# EasyEDA Pro project 立创EDA工程文件.epro

# Board PCB
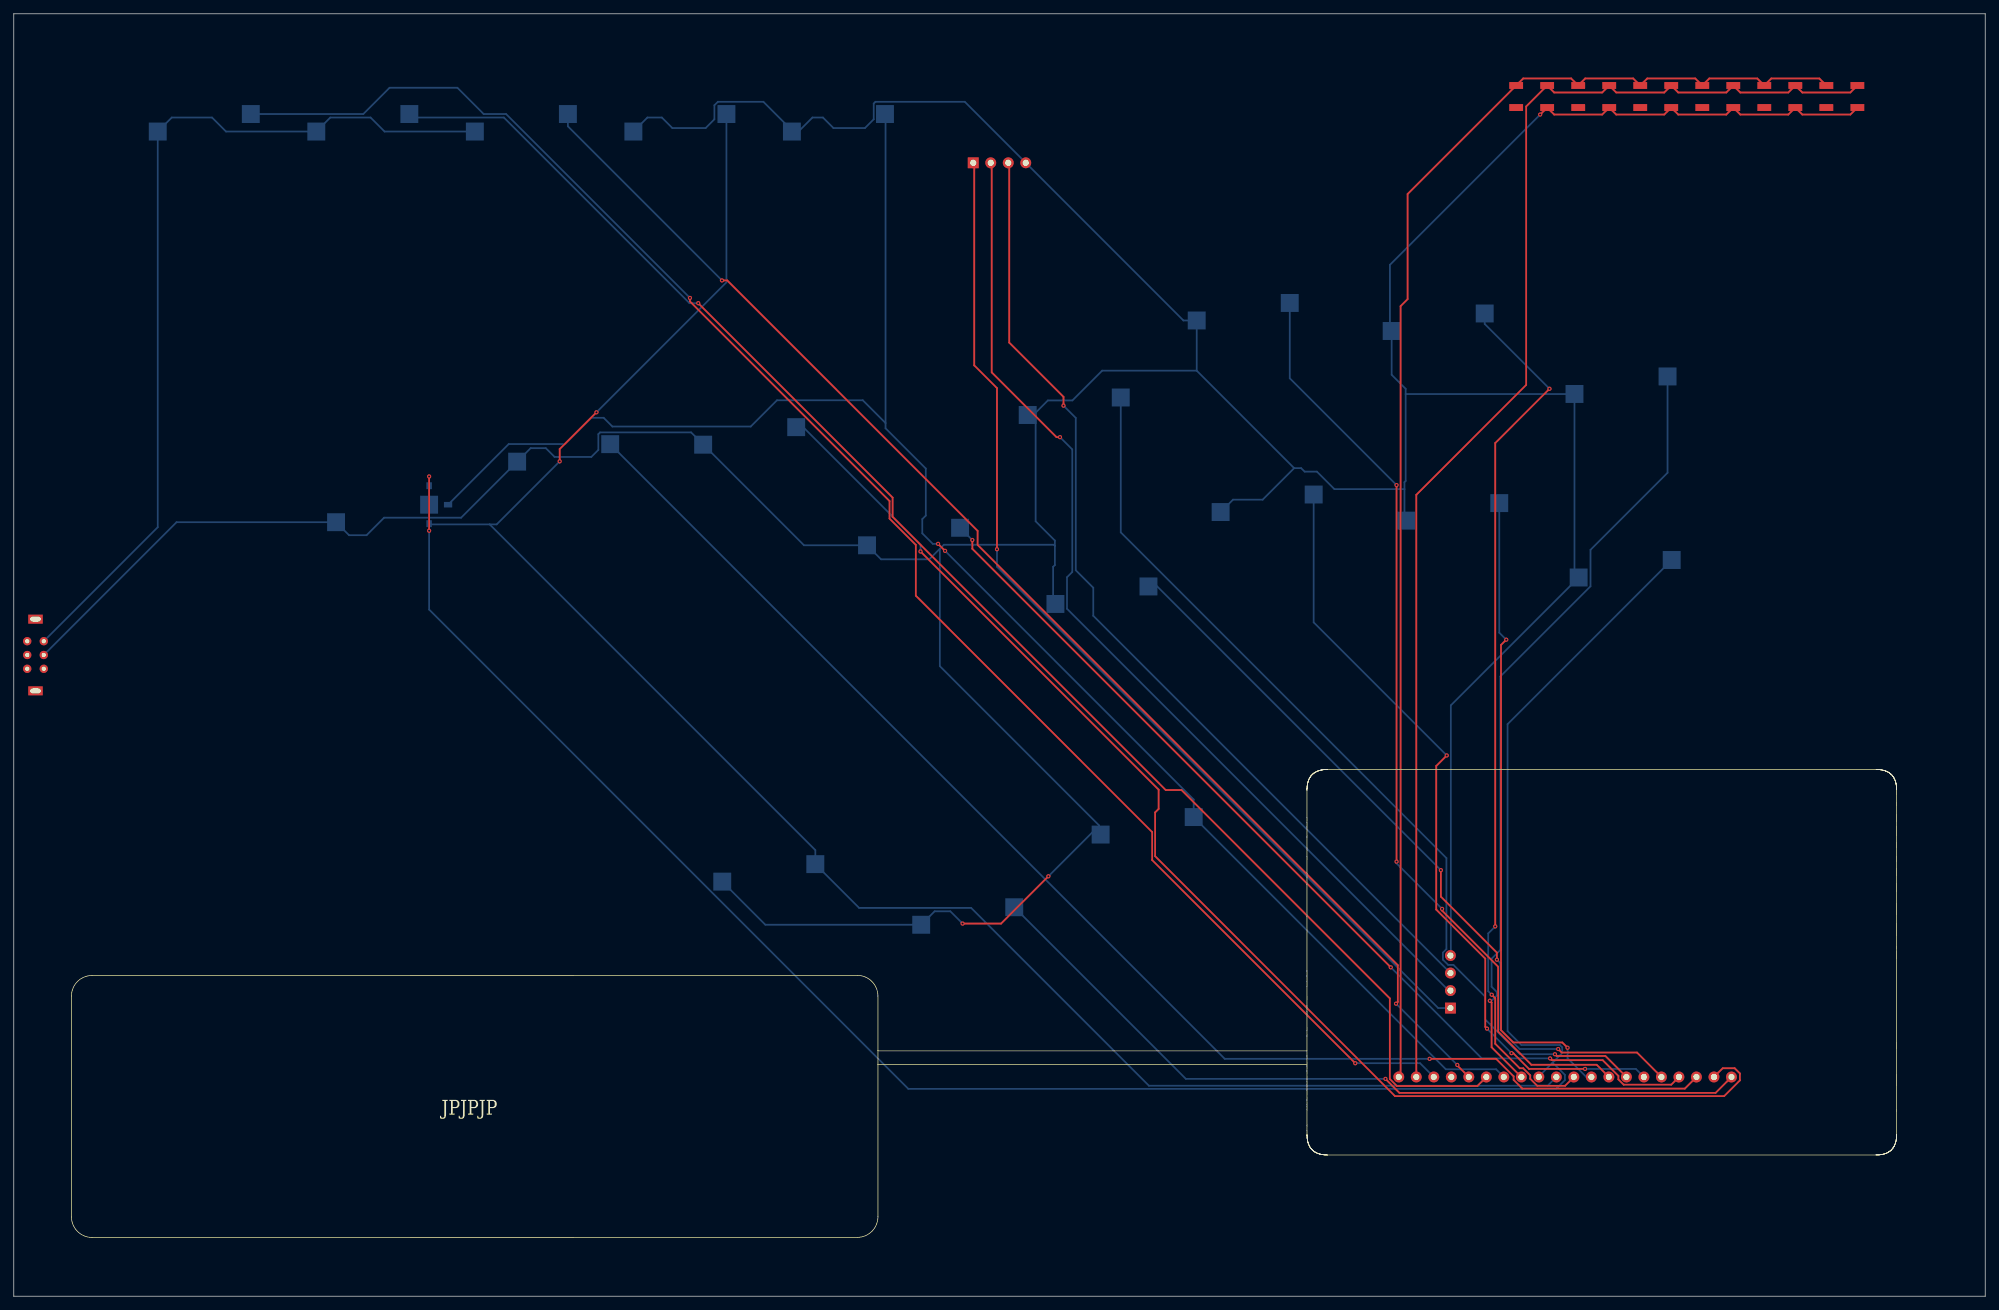
[diagram p0: board, top side]
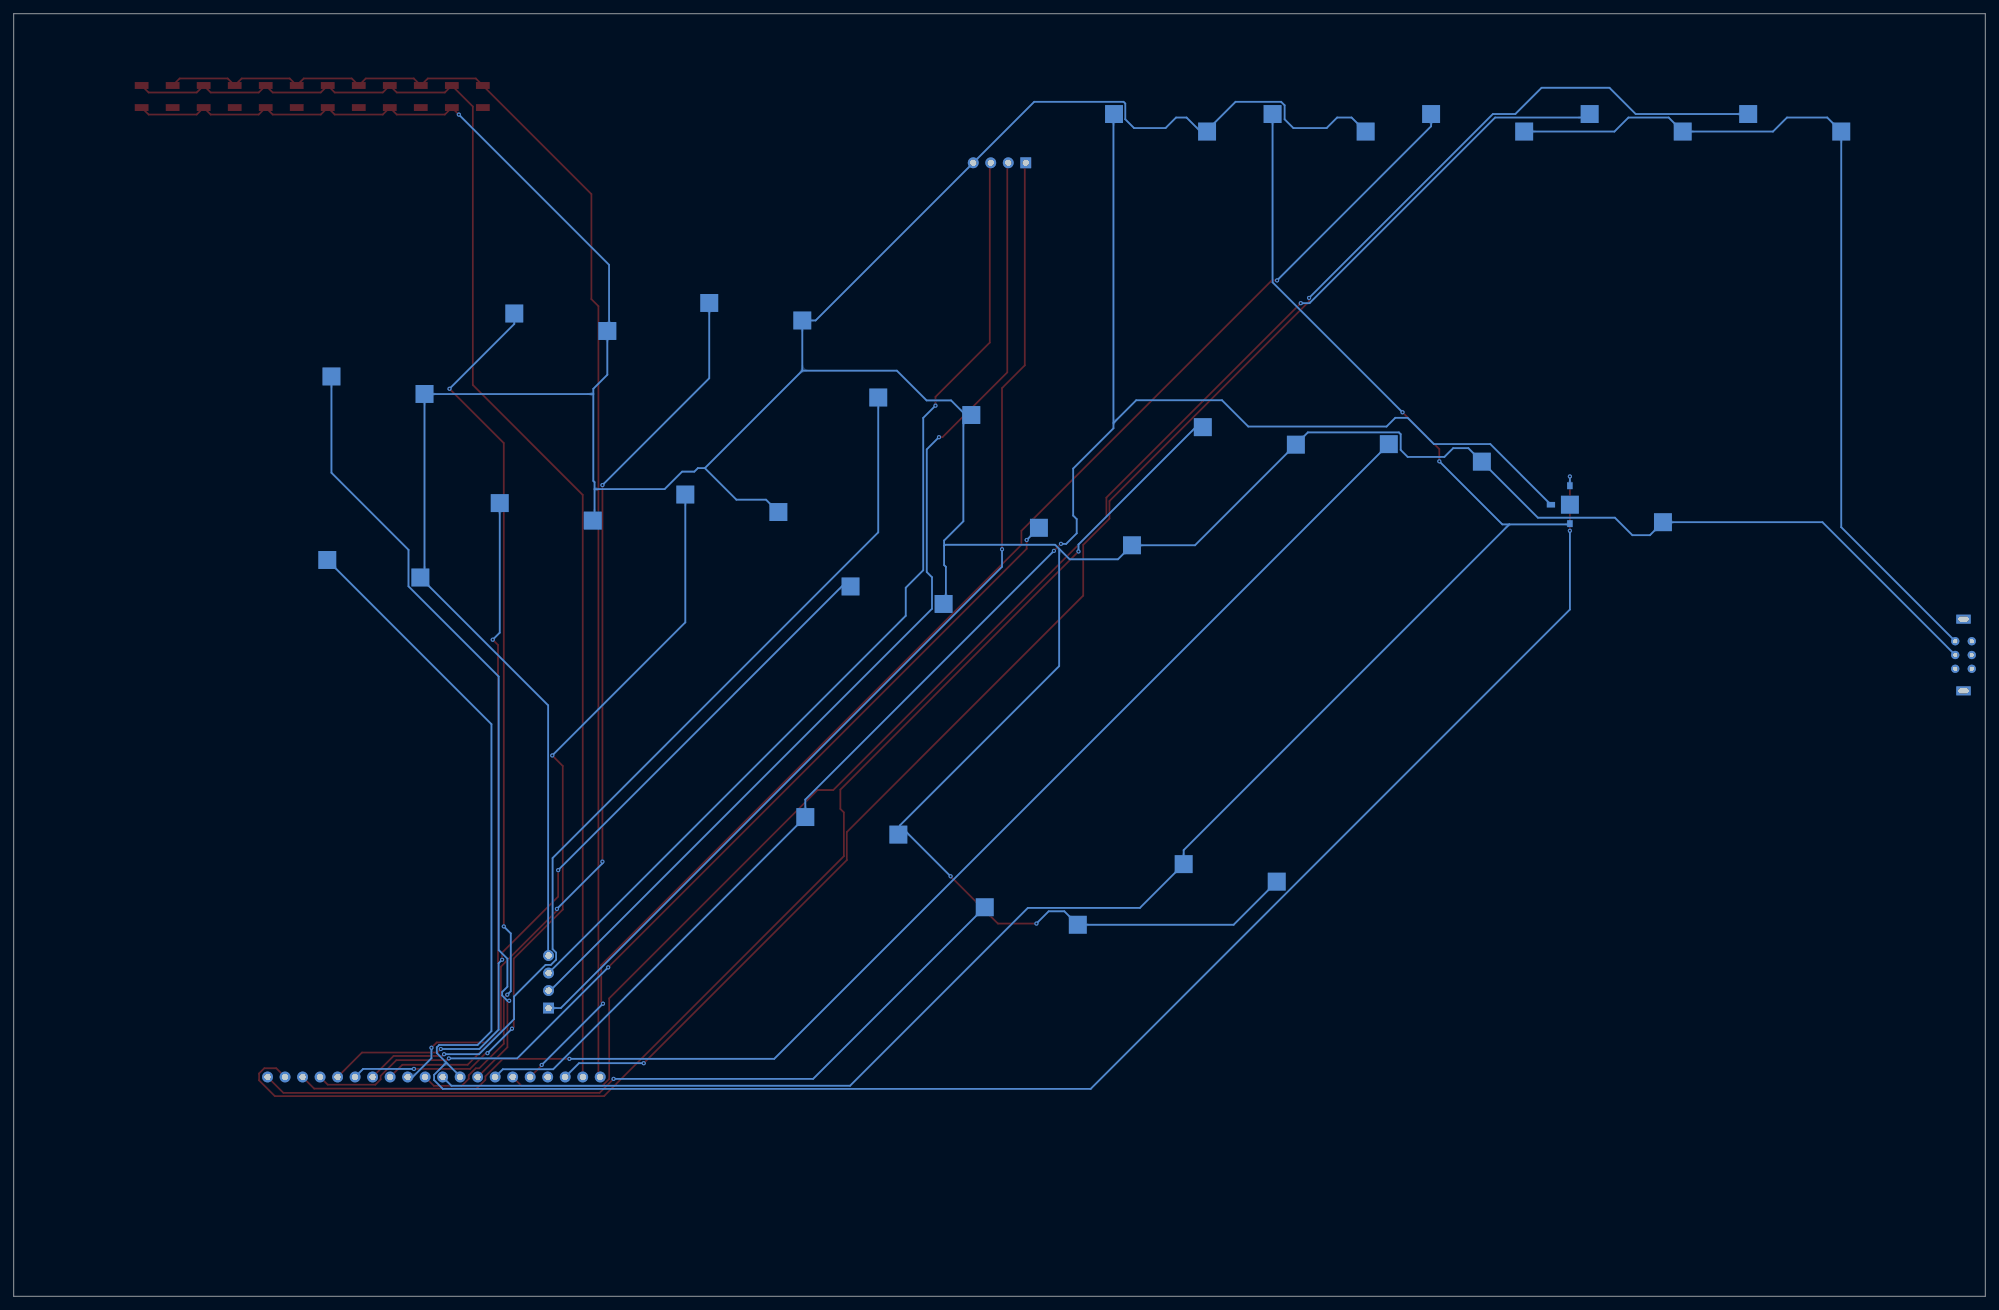
[diagram p1: board, bottom side, seen from below]

Outline 286 x 186 mm; copper layers: Top Layer, Bottom Layer. Coordinates in mm from the lower left corner of the outline.
Outline path: 0,186 286,186 286,0 0,0 0,186
Stack: Top Layer 0.035mm / Dielectric1 1.51mm FR4 er 4.5 / Bottom Layer 0.035mm

## Design rules (mm)
template: JLCPCB Capability(Two Layers Board)
spacing copperThickness1oz (default): track to track 0.102, other pairs 0.152 to 0.3
spacing copperThickness2oz: track to track 0.203, other pairs 0.152 to 0.3
track width copperThickness1oz (default): min 0.127, default 0.254, max 2.54
track width copperThickness2oz: min 0.203, default 0.254, max 2.54
differential pair differentialPair (default): width min 0.127, default 0.254, max 2.54; gap min 0.152, default 0.152
via viaSize (default): diameter min 0.5, default 0.61, max 10; hole min 0.3, default 0.305, max 6.3

## Placement (name value [footprint] x y rotation side)
NOREF  -  [Pad_e293]  215.5 115.03 0 top
NOREF#2  -  [Pad_e256]  239.03 31.79 0 top
NOREF#3  -  [Pad_e380]  60.25 117.55 180 top
NOREF#4  -  [Pad_e311]  103.39 171.46 0 top
NOREF#5  -  [Pad_e259]  246.65 31.79 0 top
NOREF#6  -  [Pad_e306]  20.89 168.92 0 top
NOREF#7  -  [Pad_ie246]  231.45 175.6 0 top
NOREF#8  -  [Pad_e307]  57.38 171.46 0 top
NOREF#9  -  [Pad_e254]  233.95 31.79 0 top
NOREF#10  -  [Pad_e247]  216.17 31.79 0 top
NOREF#11  -  [Pad_e248]  218.71 31.79 0 top
NOREF#12  -  [Pad_e310]  66.89 168.92 0 top
NOREF#13  -  [Pad_e291]  240.52 106.78 0 top
NOREF#14  -  [Pad_ie259]  253.95 172.4 0 top
NOREF#15  -  [Pad_ie264]  262.95 175.6 0 top
NOREF#16  -  [Pad_ie253]  249.45 172.4 0 top
NOREF#17  -  [Pad_e249]  221.25 31.79 0 top
NOREF#18  -  [Pad_e239]  206.01 31.79 0 top
NOREF#19  -  [Pad_e282]  46.75 112.26 0 top
NOREF#20  -  [Pad_e253]  231.41 31.79 0 top
NOREF#21  -  [Pad_e281]  60.25 114.8 0 top
NOREF#22  -  [Pad_ie249]  240.45 172.4 0 top
NOREF#23  -  [Pad_e301]  145.14 56.41 0 top
NOREF#24  -  [Pad_e339]  3.15 87.8 0 top
NOREF#25  -  [Pad_e290]  226.41 130.86 0 top
NOREF#26  -  [Pad_e308]  43.88 168.92 0 top
NOREF#27  -  [Pad_e302]  131.64 53.87 0 top
NOREF#28  -  [Pad_e379]  63 114.8 90 top
NOREF#29  -  [Pad_e292]  227.02 104.24 0 top
NOREF#30  -  [Pad_e260]  249.19 31.79 0 top
NOREF#31  -  [Pad_e287]  213.39 142.53 0 top
NOREF#32  -  [Pad_ie256]  244.95 175.6 0 top
NOREF#33  -  [Pad_e243]  208.42 41.79 270 top
NOREF#34  -  [Pad_e288]  199.89 139.99 0 top
NOREF#35  -  [Pad_e371]  144.27 164.39 180 top
NOREF#36  -  [Pad_e285]  185.11 144.06 0 top
NOREF#37  -  [Pad_ie255]  244.95 172.4 0 top
NOREF#38  -  [Pad_e244]  208.55 31.79 0 top
NOREF#39  -  [Pad_e274]  160.59 130.35 0 top
NOREF#40  -  [Pad_e313]  126.38 171.46 0 top
NOREF#41  -  [Pad_e295]  188.58 116.28 0 top
NOREF#42  -  [Pad_e312]  89.89 168.92 0 top
NOREF#43  -  [Pad_e276]  123.78 108.91 0 top
NOREF#44  -  [Pad_e314]  112.89 168.92 0 top
NOREF#45  -  [Pad_e324]  1.95 93 270 top
NOREF#46  -  [Pad_e278]  100.01 123.51 0 top
NOREF#47  -  [Pad_e378]  60.25 112.05 0 top
NOREF#48  -  [Pad_e325]  4.35 93 270 top
NOREF#49  -  [Pad_e296]  175.08 113.74 0 top
NOREF#50  -  [Pad_e250]  223.79 31.79 0 top
NOREF#51  -  [Pad_ie241]  222.45 172.4 0 top
NOREF#52  -  [Pad_ie242]  222.45 175.6 0 top
NOREF#53  -  [Pad_ie258]  258.45 175.6 0 top
NOREF#54  -  [Pad_e240]  208.42 46.87 270 top
NOREF#55  -  [Pad_e297]  164.61 102.94 0 top
NOREF#56  -  [Pad_ie245]  231.45 172.4 0 top
NOREF#57  -  [Pad_e242]  208.42 44.33 270 top
NOREF#58  -  [Pad_e273]  147.09 127.81 0 top
NOREF#59  -  [Pad_e323]  1.95 95 270 top
NOREF#60  -  [Pad_e294]  202 112.49 0 top
NOREF#61  -  [Pad_e252]  228.87 31.79 0 top
NOREF#62  -  [Pad_e327]  1.95 91 270 top
NOREF#63  -  [Pad_e373]  139.19 164.39 180 top
NOREF#64  -  [Pad_e303]  116.28 62.67 0 top
NOREF#65  -  [Pad_e304]  102.78 60.13 0 top
NOREF#66  -  [Pad_e238]  203.47 31.79 0 top
NOREF#67  -  [Pad_ie252]  235.95 175.6 0 top
NOREF#68  -  [Pad_e326]  4.35 91 270 top
NOREF#69  -  [Pad_e298]  151.11 100.4 0 top
NOREF#70  -  [Pad_e372]  146.81 164.39 180 top
NOREF#71  -  [Pad_e275]  137.28 111.45 0 top
NOREF#72  -  [Pad_e300]  157.67 66.95 0 top
NOREF#73  -  [Pad_ie254]  249.45 175.6 0 top
NOREF#74  -  [Pad_e246]  213.63 31.79 0 top
NOREF#75  -  [Pad_e299]  171.17 69.49 0 top
NOREF#76  -  [Pad_e245]  211.09 31.79 0 top
NOREF#77  -  [Pad_e286]  171.61 141.52 0 top
NOREF#78  -  [Pad_e309]  80.39 171.46 0 top
NOREF#79  -  [Pad_ie243]  217.95 172.4 0 top
NOREF#80  -  [Pad_ie244]  217.95 175.6 0 top
NOREF#81  -  [Pad_ie260]  253.95 175.6 0 top
NOREF#82  -  [Pad_e279]  86.52 123.58 0 top
NOREF#83  -  [Pad_e251]  226.33 31.79 0 top
NOREF#84  -  [Pad_e289]  239.91 133.4 0 top
NOREF#85  -  [Pad_e258]  244.11 31.79 0 top
NOREF#86  -  [Pad_e277]  113.51 126.05 0 top
NOREF#87  -  [Pad_e255]  236.49 31.79 0 top
NOREF#88  -  [Pad_e237]  200.93 31.79 0 top
NOREF#89  -  [Pad_ie250]  240.45 175.6 0 top
NOREF#90  -  [Pad_e322]  4.35 95 270 top
NOREF#91  -  [Pad_ie262]  267.45 175.6 0 top
NOREF#92  -  [Pad_ie248]  226.95 175.6 0 top
NOREF#93  -  [Pad_e338]  3.15 98.2 0 top
NOREF#94  -  [Pad_ie247]  226.95 172.4 0 top
NOREF#95  -  [Pad_e257]  241.57 31.79 0 top
NOREF#96  -  [Pad_ie261]  267.45 172.4 0 top
NOREF#97  -  [Pad_e370]  141.73 164.39 180 top
NOREF#98  -  [Pad_ie257]  258.45 172.4 0 top
NOREF#99  -  [Pad_ie251]  235.95 172.4 0 top
NOREF#100  -  [Pad_e280]  73.02 121.04 0 top
NOREF#101  -  [Pad_e305]  34.38 171.46 0 top
NOREF#102  -  [Pad_e241]  208.42 49.41 270 top
NOREF#103  -  [Pad_ie263]  262.95 172.4 0 top

## Footprints (pads in the part's own frame, mm; a bottom-side part is the same pattern mirrored in y, then rotated)
Pad_e237
  round 1.575 hole 0.889: (0,0)
Pad_e238
  round 1.575 hole 0.889: (0,0)
Pad_e239
  round 1.575 hole 0.889: (0,0)
Pad_e240
  round 1.575 hole 0.889: (0,0)
Pad_e241
  round 1.575 hole 0.889: (0,0)
Pad_e242
  round 1.575 hole 0.889: (0,0)
Pad_e243
  rect 1.575x1.575 hole 0.889: (0,0)
Pad_e244
  round 1.575 hole 0.889: (0,0)
Pad_e245
  round 1.575 hole 0.889: (0,0)
Pad_e246
  round 1.575 hole 0.889: (0,0)
Pad_e247
  round 1.575 hole 0.889: (0,0)
Pad_e248
  round 1.575 hole 0.889: (0,0)
Pad_e249
  round 1.575 hole 0.889: (0,0)
Pad_e250
  round 1.575 hole 0.889: (0,0)
Pad_e251
  round 1.575 hole 0.889: (0,0)
Pad_e252
  round 1.575 hole 0.889: (0,0)
Pad_e253
  round 1.575 hole 0.889: (0,0)
Pad_e254
  round 1.575 hole 0.889: (0,0)
Pad_e255
  round 1.575 hole 0.889: (0,0)
Pad_e256
  round 1.575 hole 0.889: (0,0)
Pad_e257
  round 1.575 hole 0.889: (0,0)
Pad_e258
  round 1.575 hole 0.889: (0,0)
Pad_e259
  round 1.575 hole 0.889: (0,0)
Pad_e260
  round 1.575 hole 0.889: (0,0)
Pad_e273
  rect 2.6x2.6 smd far side: (0,0)
Pad_e274
  rect 2.6x2.6 smd far side: (0,0)
Pad_e275
  rect 2.6x2.6 smd far side: (0,0)
Pad_e276
  rect 2.6x2.6 smd far side: (0,0)
Pad_e277
  rect 2.6x2.6 smd far side: (0,0)
Pad_e278
  rect 2.6x2.6 smd far side: (0,0)
Pad_e279
  rect 2.6x2.6 smd far side: (0,0)
Pad_e280
  rect 2.6x2.6 smd far side: (0,0)
Pad_e281
  rect 2.6x2.6 smd far side: (0,0)
Pad_e282
  rect 2.6x2.6 smd far side: (0,0)
Pad_e285
  rect 2.6x2.6 smd far side: (0,0)
Pad_e286
  rect 2.6x2.6 smd far side: (0,0)
Pad_e287
  rect 2.6x2.6 smd far side: (0,0)
Pad_e288
  rect 2.6x2.6 smd far side: (0,0)
Pad_e289
  rect 2.6x2.6 smd far side: (0,0)
Pad_e290
  rect 2.6x2.6 smd far side: (0,0)
Pad_e291
  rect 2.6x2.6 smd far side: (0,0)
Pad_e292
  rect 2.6x2.6 smd far side: (0,0)
Pad_e293
  rect 2.6x2.6 smd far side: (0,0)
Pad_e294
  rect 2.6x2.6 smd far side: (0,0)
Pad_e295
  rect 2.6x2.6 smd far side: (0,0)
Pad_e296
  rect 2.6x2.6 smd far side: (0,0)
Pad_e297
  rect 2.6x2.6 smd far side: (0,0)
Pad_e298
  rect 2.6x2.6 smd far side: (0,0)
Pad_e299
  rect 2.6x2.6 smd far side: (0,0)
Pad_e300
  rect 2.6x2.6 smd far side: (0,0)
Pad_e301
  rect 2.6x2.6 smd far side: (0,0)
Pad_e302
  rect 2.6x2.6 smd far side: (0,0)
Pad_e303
  rect 2.6x2.6 smd far side: (0,0)
Pad_e304
  rect 2.6x2.6 smd far side: (0,0)
Pad_e305
  rect 2.6x2.6 smd far side: (0,0)
Pad_e306
  rect 2.6x2.6 smd far side: (0,0)
Pad_e307
  rect 2.6x2.6 smd far side: (0,0)
Pad_e308
  rect 2.6x2.6 smd far side: (0,0)
Pad_e309
  rect 2.6x2.6 smd far side: (0,0)
Pad_e310
  rect 2.6x2.6 smd far side: (0,0)
Pad_e311
  rect 2.6x2.6 smd far side: (0,0)
Pad_e312
  rect 2.6x2.6 smd far side: (0,0)
Pad_e313
  rect 2.6x2.6 smd far side: (0,0)
Pad_e314
  rect 2.6x2.6 smd far side: (0,0)
Pad_e322
  round 1.2 hole 0.6: (0,0)
Pad_e323
  round 1.2 hole 0.6: (0,0)
Pad_e324
  round 1.2 hole 0.6: (0,0)
Pad_e325
  round 1.2 hole 0.6: (0,0)
Pad_e326
  round 1.2 hole 0.6: (0,0)
Pad_e327
  round 1.2 hole 0.6: (0,0)
Pad_e338
  rect 2.1x1.3 hole 1.5x0.7: (0,0)
Pad_e339
  rect 2.1x1.3 hole 1.5x0.7: (0,0)
Pad_e370
  round 1.575 hole 0.889: (0,0)
Pad_e371
  round 1.575 hole 0.889: (0,0)
Pad_e372
  round 1.575 hole 0.889: (0,0)
Pad_e373
  rect 1.575x1.575 hole 0.889: (0,0)
Pad_e378
  rect 0.8x1 smd far side: (0,0)
Pad_e379
  rect 0.8x1.2 smd far side: (0,0)
Pad_e380
  rect 0.8x1 smd far side: (0,0)
Pad_ie241
  rect 2x1 smd: (0,0)
Pad_ie242
  rect 2x1 smd: (0,0)
Pad_ie243
  rect 2x1 smd: (0,0)
Pad_ie244
  rect 2x1 smd: (0,0)
Pad_ie245
  rect 2x1 smd: (0,0)
Pad_ie246
  rect 2x1 smd: (0,0)
Pad_ie247
  rect 2x1 smd: (0,0)
Pad_ie248
  rect 2x1 smd: (0,0)
Pad_ie249
  rect 2x1 smd: (0,0)
Pad_ie250
  rect 2x1 smd: (0,0)
Pad_ie251
  rect 2x1 smd: (0,0)
Pad_ie252
  rect 2x1 smd: (0,0)
Pad_ie253
  rect 2x1 smd: (0,0)
Pad_ie254
  rect 2x1 smd: (0,0)
Pad_ie255
  rect 2x1 smd: (0,0)
Pad_ie256
  rect 2x1 smd: (0,0)
Pad_ie257
  rect 2x1 smd: (0,0)
Pad_ie258
  rect 2x1 smd: (0,0)
Pad_ie259
  rect 2x1 smd: (0,0)
Pad_ie260
  rect 2x1 smd: (0,0)
Pad_ie261
  rect 2x1 smd: (0,0)
Pad_ie262
  rect 2x1 smd: (0,0)
Pad_ie263
  rect 2x1 smd: (0,0)
Pad_ie264
  rect 2x1 smd: (0,0)

## Nets
GND: NOREF#16. NOREF#19. NOREF#22. NOREF#25. NOREF#27. NOREF#29. NOREF#34. NOREF#42. NOREF#43. NOREF#44. NOREF#46. NOREF#48. NOREF#49. NOREF#51. NOREF#56. NOREF#58. NOREF#60. NOREF#65. NOREF#69. NOREF#70. NOREF#72. NOREF#77. NOREF#96. NOREF#98. NOREF#100. NOREF#102.
GND1: NOREF#6. NOREF#12. NOREF#26. NOREF#90.
VCC: NOREF#15. NOREF#32. NOREF#67. NOREF#80. NOREF#81. NOREF#88. NOREF#92.
+: NOREF#33. NOREF#63.
A: NOREF#2. NOREF#55.
B: NOREF#41. NOREF#87.
D+: NOREF#35. NOREF#54.
D-: NOREF#57. NOREF#97.
DIN: NOREF#7. NOREF#52. NOREF#53. NOREF#66. NOREF#73. NOREF#89. NOREF#91.
DOWN: NOREF#5. NOREF#86.
HOME: NOREF#18. NOREF#101.
L1: NOREF. NOREF#61.
L2: NOREF#31. NOREF#83.
L3: NOREF#4. NOREF#47. NOREF#50. NOREF#64.
LEFT: NOREF#82. NOREF#85.
R1: NOREF#3. NOREF#13. NOREF#17.
R2: NOREF#11. NOREF#84.
R3: NOREF#10. NOREF#28. NOREF#40. NOREF#75.
RIGHT: NOREF#71. NOREF#95.
SELECT: NOREF#8. NOREF#74.
START: NOREF#76. NOREF#78.
UP: NOREF#23. NOREF#30.
X: NOREF#9. NOREF#39.
Y: NOREF#20. NOREF#36.

## Via types
v1: diameter 0.61, hole 0.305, Top Layer to Bottom Layer, 41 vias

## Routing (per net, layer and track width the routed paths; a pad name or vN(x,y) marks a point on that pad's centre or on a via; arc(x,y) is an arc through that point)
GND: length 741.2
  Top Layer w0.254: v1(150.09,60.91) 143.23,54.05 v1(137.64,54.05) ; v1(221.44,171.38) 222.45,172.4 223.47,171.38 230.44,171.38 231.45,172.4 232.47,171.38 239.44,171.38 240.45,172.4 241.47,171.38 248.44,171.38 249.45,172.4 250.47,171.38 257.44,171.38 258.45,172.4 259.47,171.38 266.44,171.38 267.45,172.4
  Bottom Layer w0.254: 157.46,67.26 157.46,67.17 157.67,66.95 ; 157.46,67.26 157.46,68.27 134.34,91.39 134.34,108.4 ; 157.46,67.26 156.44,67.26 v1(150.09,60.91) ; 171.61,134.24 171.61,141.52 169.68,141.52 146.81,164.39 137.96,173.24 125,173.24 124.75,172.98 124.75,170.7 123.48,169.43 118.91,169.43 117.39,170.95 115.86,170.95 113.83,168.92 113.07,168.92 ; 171.61,134.24 157.89,134.24 153.57,129.92 150.02,129.92 148.24,128.14 ; 171.61,134.24 185.75,120.1 ; 134.34,108.4 132.82,106.88 125.81,106.88 123.78,108.91 114.64,108.91 100.04,123.51 ; 134.34,108.4 134.93,108.99 150.89,108.99 151.03,108.84 ; 102.78,60.13 109.04,53.87 131.64,53.87 133.59,55.83 135.87,55.83 v1(137.64,54.05) ; 148.24,128.14 148.24,112.39 151.03,109.6 151.03,108.84 ; 148.24,128.14 147.43,128.14 147.09,127.81 ; 201.92,130.85 201.92,118.25 201.75,118.07 201.75,117.05 ; 201.92,130.85 201.92,131.61 199.89,133.64 199.89,139.99 199.64,140.25 199.64,149.59 v1(221.44,171.38) ; 201.92,130.85 226.4,130.85 226.41,130.86 226.41,104.84 227.02,104.24 208.48,85.7 208.48,49.47 208.42,49.41 ; 201.75,117.05 201.75,112.75 202,112.49 ; 201.75,117.05 191.59,117.05 189.05,119.59 187.27,119.59 186.76,120.1 185.75,120.1 ; 113.07,168.92 112.89,168.92 ; 113.07,168.92 108.75,173.24 102.15,173.24 101.64,172.73 101.64,170.7 100.37,169.43 95.54,169.43 94.02,170.95 91.92,170.95 89.89,168.92 ; 151.03,108.84 151.03,106.05 150.78,105.79 150.78,100.73 151.11,100.4 ; 185.75,120.1 181.17,115.53 176.87,115.53 175.08,113.74 ; 4.35,93 23.61,112.26 46.75,112.26 48.64,110.37 51.18,110.37 53.72,112.91 64.89,112.91 73.02,121.04 74.98,123 77.18,123 78.45,121.73 83.79,121.73 84.8,122.74 84.8,125.03 85.06,125.28 98.26,125.28 100.04,123.51 ; 100.04,123.51 100.01,123.51
GND1: length 130.1
  Bottom Layer w0.254: 4.35,95 20.89,111.53 20.89,168.92 22.92,170.95 28.76,170.95 30.79,168.92 43.88,168.92 45.92,170.95 51.76,170.95 53.79,168.92 66.89,168.92
VCC: length 200.1
  Top Layer w0.254: 200.93,31.79 201.19,32.06 201.19,143.6 202.2,144.61 202.2,159.85 218.97,176.62 225.94,176.62 226.95,175.6 227.97,176.62 234.94,176.62 235.95,175.6 236.97,176.62 243.94,176.62 244.95,175.6 245.97,176.62 252.94,176.62 253.95,175.6 254.97,176.62 261.94,176.62 262.95,175.6
+: length 152.3
  Top Layer w0.254: v1(142.63,108.34) 142.63,131.71 139.33,135.01 139.33,164.25 139.19,164.39
  Bottom Layer w0.254: 208.42,41.79 206.64,41.79 142.63,105.8 v1(142.63,108.34)
A: length 112.4
  Top Layer w0.254: v1(215.16,48.81) 215.16,49.82 207.03,57.95 v1(207.03,61.79) ; 239.03,31.79 235.48,35.34 224.56,35.34 v1(224.05,35.85)
  Bottom Layer w0.254: v1(207.03,61.79) 165.88,102.94 164.61,102.94 ; v1(215.16,48.81) 215.67,48.3 215.67,38.65 218.46,35.85 v1(224.05,35.85)
B: length 114.8
  Top Layer w0.254: v1(217.28,35.25) 217.53,35.25 219.82,32.96 v1(227.95,32.96) ; v1(213.72,38.81) 213.47,39.06 213.47,48.97 206.36,56.08 206.36,76.91 v1(207.88,78.43)
  Bottom Layer w0.254: v1(227.95,32.96) 235.32,32.96 236.49,31.79 ; v1(207.88,78.43) 188.58,97.73 188.58,116.28 ; v1(213.72,38.81) v1(217.28,35.25)
D+: length 144.1
  Top Layer w0.254: v1(152.28,129.17) 152.28,130.44 144.41,138.31 144.41,164.25 144.27,164.39
  Bottom Layer w0.254: v1(152.28,129.17) 154.06,127.39 154.06,105.29 156.6,102.75 156.6,98.69 208.42,46.87
D-: length 148.8
  Top Layer w0.254: v1(151.78,124.6) 151.27,124.6 141.87,133.99 141.87,164.25 141.73,164.39
  Bottom Layer w0.254: v1(151.78,124.6) 153.55,122.82 153.55,105.04 152.79,104.28 152.79,99.7 208.16,44.33 208.42,44.33
DIN: length 200.9
  Top Layer w0.254: 267.45,175.6 266.44,174.58 259.47,174.58 258.45,175.6 257.44,174.58 250.47,174.58 249.45,175.6 248.44,174.58 241.47,174.58 240.45,175.6 239.44,174.58 232.47,174.58 231.45,175.6 230.44,174.58 223.47,174.58 222.45,175.6 219.4,172.55 219.4,132.17 203.47,116.23 203.47,31.79
DOWN: length 190.6
  Top Layer w0.254: v1(131.54,108.01) 166.08,73.47 166.08,70.67 165.58,70.17 165.58,63.82 200.37,29.02 248.13,29.02 250.41,31.3 250.41,32.3 249.65,33.06 247.92,33.06 246.65,31.79
  Bottom Layer w0.254: 113.51,126.05 114.52,126.05 131.54,109.03 v1(131.54,108.01)
HOME: length 241.1
  Top Layer w0.254: v1(98.09,144.79) 98.09,144.28 127.05,115.33 127.05,112.79 130.86,108.98 130.86,101.61 165.15,67.32 165.15,63.26 v1(194.61,33.79)
  Bottom Layer w0.254: 206.01,31.79 204.01,33.79 v1(194.61,33.79) ; 34.38,171.46 50.7,171.46 54.51,175.27 64.36,175.27 68.17,171.46 71.42,171.46 v1(98.09,144.79)
L1: length 94
  Top Layer w0.254: v1(225.41,36.04) 224.65,36.8 217.53,36.8 215.76,38.58 215.76,94.46 v1(216.52,95.22)
  Bottom Layer w0.254: 228.87,31.79 228.13,31.79 225.41,34.51 v1(225.41,36.04) ; v1(216.52,95.22) 215.5,96.24 215.5,115.03
L2: length 128.7
  Top Layer w0.254: v1(214.41,43.73) 214.91,43.22 214.91,36.61 218.47,33.06 218.98,33.06 220,32.04 220,31.53 221.01,30.52 225.05,30.52 226.33,31.79 ; v1(222.79,131.61) 214.91,123.74 v1(214.91,53.63)
  Bottom Layer w0.254: 213.39,142.53 213.39,141.01 v1(222.79,131.61) ; v1(214.41,43.73) 213.9,44.23 213.9,52.62 v1(214.91,53.63)
L3: length 273.4
  Top Layer w0.254: v1(84.53,128.2) 79.2,122.87 v1(79.2,121.09)
  Bottom Layer w0.254: 223.79,31.79 222.52,30.53 164.68,30.53 138.89,56.32 122.63,56.32 116.28,62.67 116.28,64.7 69.04,111.94 ; 69.04,111.94 70.05,111.94 v1(79.2,121.09) ; 69.04,111.94 60.36,111.94 60.25,112.05 ; 103.39,171.46 103.39,147.05 v1(84.53,128.2)
LEFT: length 197.3
  Top Layer w0.254: v1(205.39,34.43) 215.05,34.43 217.59,31.89 217.59,31.38 218.86,30.11 242.42,30.11 244.11,31.79
  Bottom Layer w0.254: v1(205.39,34.43) 175.68,34.43 86.52,123.58
R1: length 310.8
  Top Layer w0.254: v1(60.25,111.02) v1(60.25,118.9)
  Bottom Layer w0.254: 223.25,33.88 225.02,32.1 225.02,31.34 223.75,30.07 129.77,30.07 60.25,99.59 v1(60.25,111.02) ; 223.25,33.88 221.25,31.88 221.25,31.79 ; 223.25,33.88 224.63,35.27 224.63,36.09 224.29,36.44 218.71,36.44 216.71,38.44 216.71,82.97 240.52,106.78 ; v1(60.25,118.9) 60.25,117.55
R2: length 115
  Top Layer w0.254: 218.71,31.79 214.39,36.11 214.39,42.6 v1(214.13,42.85)
  Bottom Layer w0.254: 239.91,133.4 239.91,119.43 228.74,108.25 228.74,102.96 215.66,89.89 215.66,50.22 214.39,48.95 214.39,44.88 215.15,44.12 215.15,43.61 214.39,42.85 v1(214.13,42.85)
R3: length 254.2
  Top Layer w0.254: v1(135.1,108.1) v1(134.09,109.12)
  Bottom Layer w0.254: v1(134.09,109.12) 133.32,109.12 131.8,110.64 131.8,112.71 132.31,113.22 132.31,120.04 126.47,125.88 126.47,126.64 ; 63,114.8 71.8,123.6 79.98,123.6 83.79,127.41 85.57,127.41 86.84,126.14 106.91,126.14 110.72,129.95 123.16,129.95 126.47,126.64 ; 216.17,31.79 215.04,32.92 207.75,32.92 171.17,69.49 171.17,72.03 v1(135.1,108.1) ; 126.38,171.46 126.47,171.38 126.47,126.64
RIGHT: length 139.2
  Top Layer w0.254: v1(222.88,34.49) 223.13,34.24 230.5,34.24 232.78,31.95 232.78,31.44 233.55,30.68 240.45,30.68 241.57,31.79 ; v1(139.06,109.67) 139.06,108.4 v1(199.77,47.7)
  Bottom Layer w0.254: v1(222.88,34.49) 212.97,34.49 v1(199.77,47.7) ; 137.28,111.45 v1(139.06,109.67)
SELECT: length 223.7
  Top Layer w0.254: 213.63,31.79 212.32,30.49 200.64,30.49 199.62,31.51 199.62,43.19 169.4,73.42 167.11,73.42 127.49,113.04 127.49,115.83 v1(99.3,144.03)
  Bottom Layer w0.254: 57.38,171.46 57.89,170.95 71.1,170.95 98.03,144.03 v1(99.3,144.03)
START: length 194.5
  Top Layer w0.254: v1(209.42,33.54) 209.42,33.46 211.09,31.79 ; v1(102.74,147.33) 103.5,147.33 139.82,111.01 139.82,108.98 200.78,48.02 200.78,42.68 v1(200.53,42.43)
  Bottom Layer w0.254: 80.39,171.46 80.39,169.68 v1(102.74,147.33) ; v1(200.53,42.43) v1(209.42,33.54)
UP: length 116.2
  Top Layer w0.254: v1(198.99,31.52) 201.02,29.49 246.88,29.49 249.19,31.79
  Bottom Layer w0.254: 145.14,56.41 170.03,31.52 v1(198.99,31.52)
X: length 136.9
  Top Layer w0.254: v1(223.58,35.1) 223.84,34.84 230.9,34.84 233.95,31.79
  Bottom Layer w0.254: 160.59,130.35 160.59,110.79 207.83,63.55 207.83,50.34 207.33,49.83 207.33,48.81 208.09,48.05 208.85,48.05 213.42,43.48 213.42,40.18 218.5,35.1 v1(223.58,35.1)
Y: length 137
  Top Layer w0.254: v1(207.21,56.17) 207.21,55.92 215.33,47.79 215.33,38.39 220.16,33.57 229.63,33.57 231.41,31.79 ; v1(200.6,117.64) v1(200.6,63.03)
  Bottom Layer w0.254: v1(207.21,56.17) 200.6,62.78 v1(200.6,63.03) ; 185.11,144.06 185.11,133.14 v1(200.6,117.64)

Small or netless copper shapes (teardrops, artwork), in the pictures only: 81 on Top Layer, 114 on Bottom Layer

## Text on the board
Top Silkscreen Layer: JPJPJP

# Board A4标准轴
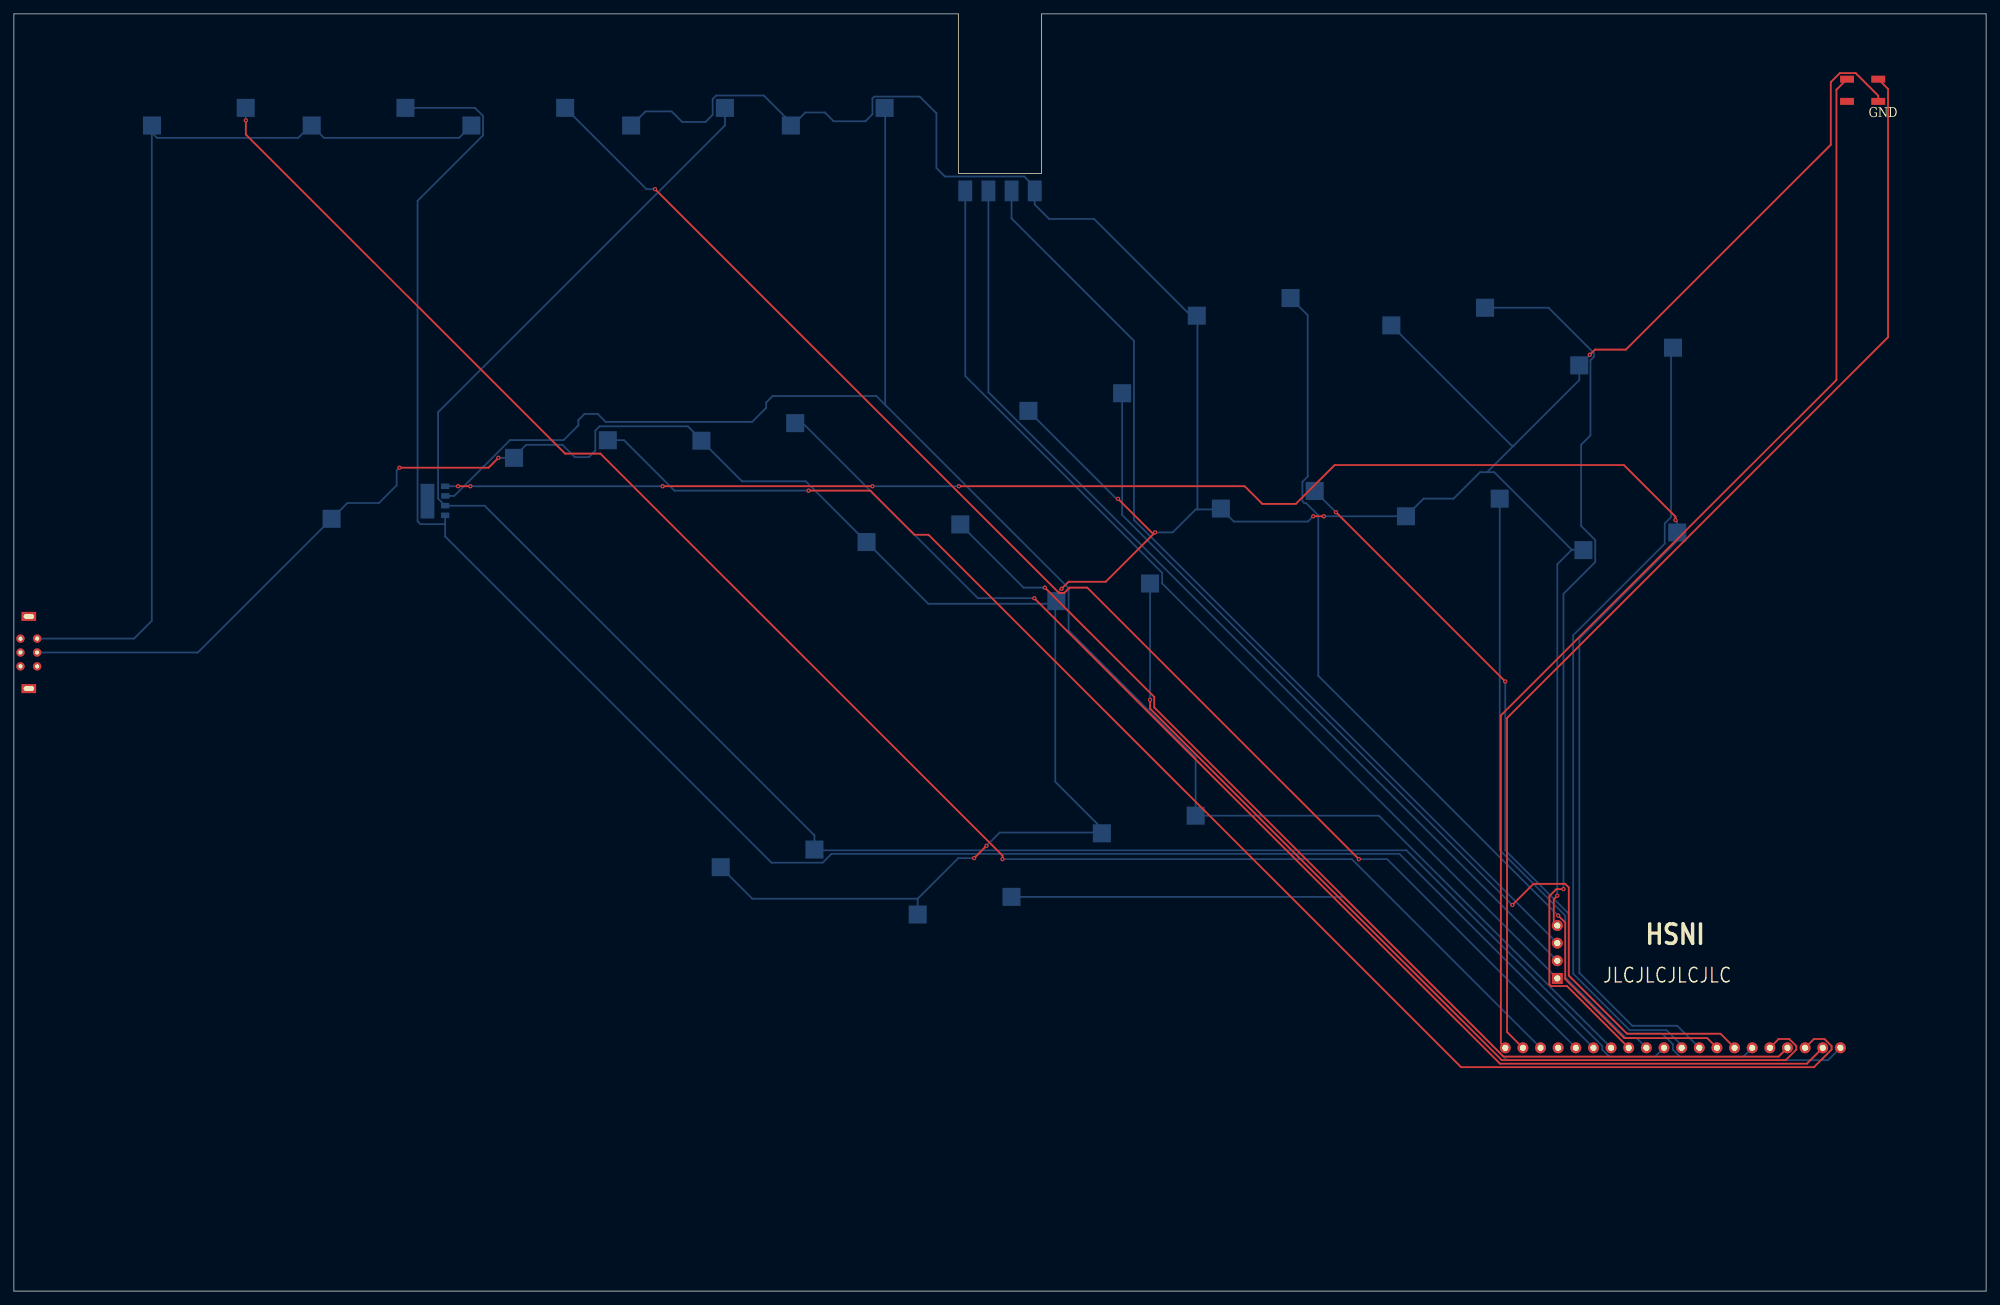
[diagram p2: board, top side]
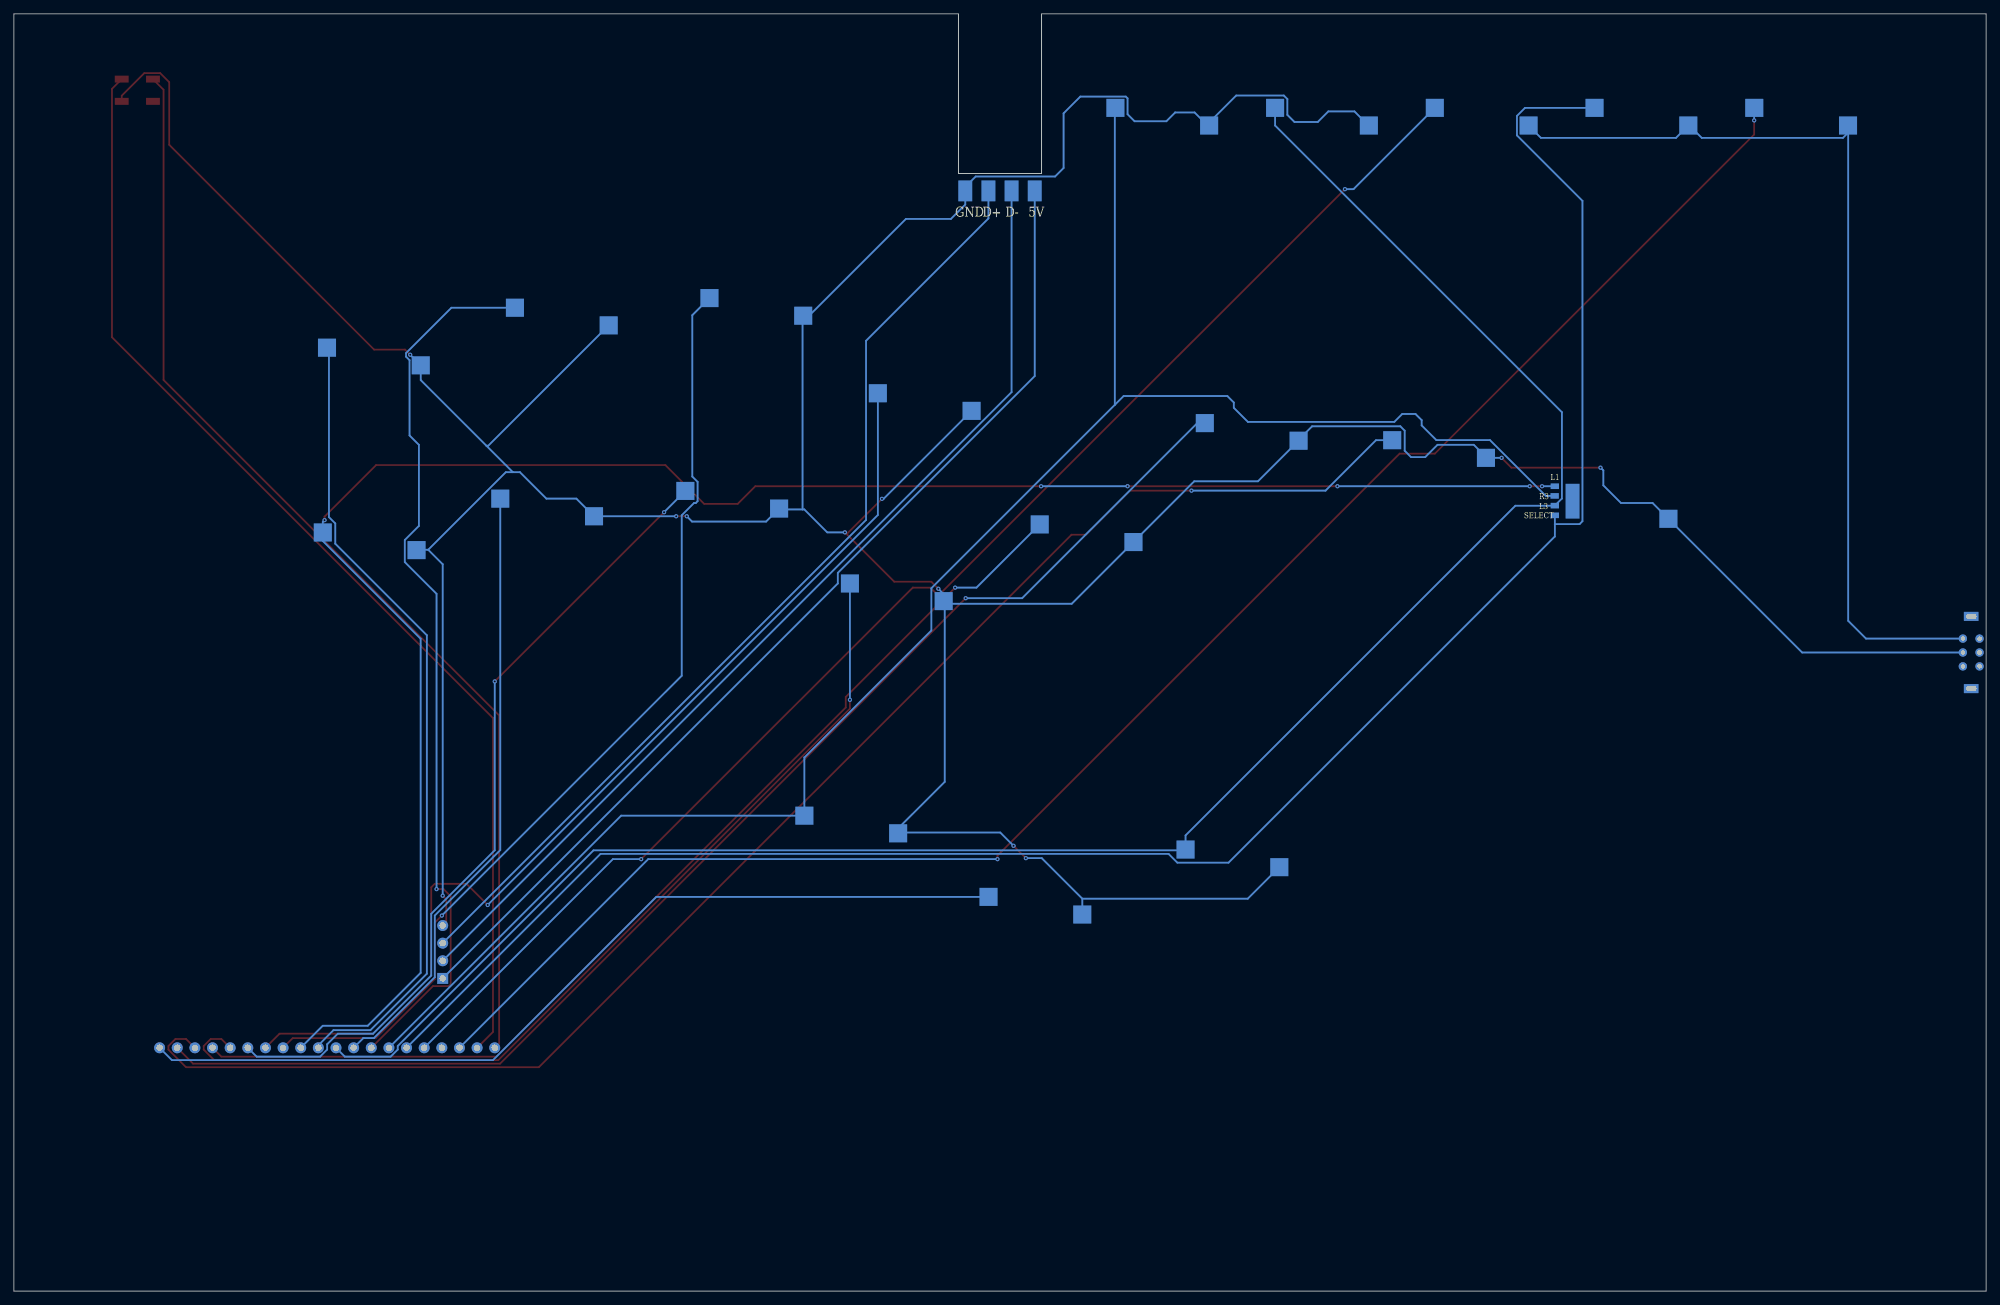
[diagram p3: board, bottom side, seen from below]

Outline 284 x 184 mm; copper layers: Top Layer, Bottom Layer. Coordinates in mm from the lower left corner of the outline.
Outline path: 0,184 136,184 136,161 148,161 148,184 284,184 284,0 0,0 0,184
Stack: Top Layer 0.035mm / Dielectric1 1.51mm FR4 er 4.5 / Bottom Layer 0.035mm

## Design rules (mm)
template: JLCPCB Capability(Two Layers Board)
spacing copperThickness1oz (default): track to track 0.102, other pairs 0.152 to 0.3
spacing copperThickness2oz: track to track 0.203, other pairs 0.152 to 0.3
track width copperThickness1oz (default): min 0.127, default 0.254, max 2.54
track width copperThickness2oz: min 0.203, default 0.254, max 2.54
differential pair differentialPair (default): width min 0.127, default 0.254, max 2.54; gap min 0.152, default 0.152
via viaSize (default): diameter min 0.5, default 0.61, max 10; hole min 0.3, default 0.305, max 6.3

## Placement (name value [footprint] x y rotation side)
NOREF  -  [Pad_e381]  2.15 97.2 0 top
NOREF#2  -  [Pad_ie763]  268.47 174.6 0 top
NOREF#3  -  [Pad_e667]  99.01 122.51 0 top
NOREF#4  -  [Pad_e500]  260.48 35.05 0 top
NOREF#5  -  [Pad_e385]  214.76 35.05 0 top
NOREF#6  -  [Pad_e630]  79.39 170.46 0 top
NOREF#7  -  [Pad_e607]  19.89 167.92 0 top
NOREF#8  -  [Pad_e388]  222.25 50.13 270 top
NOREF#9  -  [Pad_e375]  0.95 94 270 top
NOREF#10  -  [Pad_e724]  187.31 115.28 0 top
NOREF#11  -  [Pad_e675]  136.28 110.45 0 top
NOREF#12  -  [Pad_ie762]  263.97 174.6 0 top
NOREF#13  -  [Pad_e556]  137 158.5 180 top
NOREF#14  -  [Pad_e395]  230 35.05 0 top
NOREF#15  -  [Pad_e681]  146.09 126.81 0 top
NOREF#16  -  [Pad_e650]  45.75 111.26 0 top
NOREF#17  -  [Pad_e389]  222.25 52.67 270 top
NOREF#18  -  [Pad_e717]  239.52 109.29 0 top
NOREF#19  -  [Pad_e374]  0.95 90 270 top
NOREF#20  -  [Pad_e737]  101.78 61.07 0 top
NOREF#21  -  [Pad_e623]  56.39 170.46 0 top
NOREF#22  -  [Pad_e404]  252.86 35.05 0 top
NOREF#23  -  [Pad_e637]  102.39 170.46 0 top
NOREF#24  -  [Pad_e654]  62.13 114.56 90 top
NOREF#25  -  [Pad_e745]  143.65 56.79 0 top
NOREF#26  -  [Pad_ie761]  268.47 171.4 0 top
NOREF#27  -  [Pad_e660]  72.02 120.04 0 top
NOREF#28  -  [Pad_e401]  245.24 35.05 0 top
NOREF#29  -  [Pad_e652]  59.55 113.8 0 top
NOREF#30  -  [Pad_e396]  232.54 35.05 0 top
NOREF#31  -  [Pad_e392]  222.38 35.05 0 top
NOREF#32  -  [Pad_e377]  2.15 86.8 0 top
NOREF#33  -  [Pad_e386]  217.3 35.05 0 top
NOREF#34  -  [Pad_e505]  263.02 35.05 0 top
NOREF#35  -  [Pad_e611]  33.38 170.46 0 top
NOREF#36  -  [Pad_e682]  159.59 129.35 0 top
NOREF#37  -  [Pad_e405]  255.4 35.05 0 top
NOREF#38  -  [Pad_e738]  115.28 63.61 0 top
NOREF#39  -  [Pad_e695]  225.41 133.37 0 top
NOREF#40  -  [Pad_e661]  85.52 122.58 0 top
NOREF#41  -  [Pad_e674]  122.78 107.91 0 top
NOREF#42  -  [Pad_e744]  130.15 54.25 0 top
NOREF#43  -  [Pad_e723]  173.81 112.74 0 top
NOREF#44  -  [Pad_e644]  125.38 170.46 0 top
NOREF#45  -  [Pad_e399]  240.16 35.05 0 top
NOREF#46  -  [Pad_e382]  3.35 92 270 top
NOREF#47  -  [Pad_e689]  183.84 143.06 0 top
NOREF#48  -  [Pad_e541]  140.33 158.5 180 top
NOREF#49  -  [Pad_e400]  242.7 35.05 0 top
NOREF#50  -  [Pad_e499]  257.94 35.05 0 top
NOREF#51  -  [Pad_e702]  198.35 139.13 0 top
NOREF#52  -  [Pad_e622]  42.88 167.92 0 top
NOREF#53  -  [Pad_e359]  62.1 115.95 90 top
NOREF#54  -  [Pad_e394]  227.46 35.05 0 top
NOREF#55  -  [Pad_e688]  170.34 140.52 0 top
NOREF#56  -  [Pad_e668]  112.51 125.05 0 top
NOREF#57  -  [Pad_e403]  250.32 35.05 0 top
NOREF#58  -  [Pad_e629]  65.89 167.92 0 top
NOREF#59  -  [Pad_e383]  3.35 90 270 top
NOREF#60  -  [Pad_e731]  163.61 101.94 0 top
NOREF#61  -  [Pad_e636]  88.89 167.92 0 top
NOREF#62  -  [Pad_ie760]  263.97 171.4 0 top
NOREF#63  -  [Pad_e716]  226.02 106.75 0 top
NOREF#64  -  [Pad_e643]  111.89 167.92 0 top
NOREF#65  -  [Pad_e393]  224.92 35.05 0 top
NOREF#66  -  [Pad_e402]  247.78 35.05 0 top
NOREF#67  -  [Pad_e384]  3.35 94 270 top
NOREF#68  -  [Pad_e730]  150.11 99.4 0 top
NOREF#69  -  [Pad_e696]  238.91 135.91 0 top
NOREF#70  -  [Pad_e387]  219.84 35.05 0 top
NOREF#71  -  [Pad_e531]  147 158.5 180 top
NOREF#72  -  [Pad_e751]  156.67 65.95 0 top
NOREF#73  -  [Pad_e358]  62.1 111.76 90 top
NOREF#74  -  [Pad_e397]  235.08 35.05 0 top
NOREF#75  -  [Pad_e391]  222.25 45.05 270 top
NOREF#76  -  [Pad_e710]  213.96 114.17 0 top
NOREF#77  -  [Pad_e357]  62.1 113.16 90 top
NOREF#78  -  [Pad_e703]  211.85 141.67 0 top
NOREF#79  -  [Pad_e752]  170.17 68.49 0 top
NOREF#80  -  [Pad_e376]  0.95 92 270 top
NOREF#81  -  [Pad_e709]  200.46 111.63 0 top
NOREF#82  -  [Pad_e390]  222.25 47.59 270 top
NOREF#83  -  [Pad_e398]  237.62 35.05 0 top
NOREF#84  -  [Pad_e534]  143.67 158.5 180 top

## Footprints (pads in the part's own frame, mm; a bottom-side part is the same pattern mirrored in y, then rotated)
Pad_e357
  rect 0.8x1.2 smd far side: (0,0)
Pad_e358
  rect 0.8x1.2 smd far side: (0,0)
Pad_e359
  rect 0.8x1.2 smd far side: (0,0)
Pad_e374
  round 1.2 hole 0.6: (0,0)
Pad_e375
  round 1.2 hole 0.6: (0,0)
Pad_e376
  round 1.2 hole 0.6: (0,0)
Pad_e377
  rect 2.1x1.3 hole 1.5x0.7: (0,0)
Pad_e381
  rect 2.1x1.3 hole 1.5x0.7: (0,0)
Pad_e382
  round 1.2 hole 0.6: (0,0)
Pad_e383
  round 1.2 hole 0.6: (0,0)
Pad_e384
  round 1.2 hole 0.6: (0,0)
Pad_e385
  round 1.575 hole 0.889: (0,0)
Pad_e386
  round 1.575 hole 0.889: (0,0)
Pad_e387
  round 1.575 hole 0.889: (0,0)
Pad_e388
  round 1.575 hole 0.889: (0,0)
Pad_e389
  round 1.575 hole 0.889: (0,0)
Pad_e390
  round 1.575 hole 0.889: (0,0)
Pad_e391
  rect 1.575x1.575 hole 0.889: (0,0)
Pad_e392
  round 1.575 hole 0.889: (0,0)
Pad_e393
  round 1.575 hole 0.889: (0,0)
Pad_e394
  round 1.575 hole 0.889: (0,0)
Pad_e395
  round 1.575 hole 0.889: (0,0)
Pad_e396
  round 1.575 hole 0.889: (0,0)
Pad_e397
  round 1.575 hole 0.889: (0,0)
Pad_e398
  round 1.575 hole 0.889: (0,0)
Pad_e399
  round 1.575 hole 0.889: (0,0)
Pad_e400
  round 1.575 hole 0.889: (0,0)
Pad_e401
  round 1.575 hole 0.889: (0,0)
Pad_e402
  round 1.575 hole 0.889: (0,0)
Pad_e403
  round 1.575 hole 0.889: (0,0)
Pad_e404
  round 1.575 hole 0.889: (0,0)
Pad_e405
  round 1.575 hole 0.889: (0,0)
Pad_e499
  round 1.575 hole 0.889: (0,0)
Pad_e500
  round 1.575 hole 0.889: (0,0)
Pad_e505
  round 1.575 hole 0.889: (0,0)
Pad_e531
  rect 2x3 smd far side: (0,0)
Pad_e534
  rect 2x3 smd far side: (0,0)
Pad_e541
  rect 2x3 smd far side: (0,0)
Pad_e556
  rect 2x3 smd far side: (0,0)
Pad_e607
  rect 2.6x2.6 smd far side: (0,0)
Pad_e611
  rect 2.6x2.6 smd far side: (0,0)
Pad_e622
  rect 2.6x2.6 smd far side: (0,0)
Pad_e623
  rect 2.6x2.6 smd far side: (0,0)
Pad_e629
  rect 2.6x2.6 smd far side: (0,0)
Pad_e630
  rect 2.6x2.6 smd far side: (0,0)
Pad_e636
  rect 2.6x2.6 smd far side: (0,0)
Pad_e637
  rect 2.6x2.6 smd far side: (0,0)
Pad_e643
  rect 2.6x2.6 smd far side: (0,0)
Pad_e644
  rect 2.6x2.6 smd far side: (0,0)
Pad_e650
  rect 2.6x2.6 smd far side: (0,0)
Pad_e652
  rect 2x5 smd far side: (0,0)
Pad_e654
  rect 0.8x1.2 smd far side: (0,0)
Pad_e660
  rect 2.6x2.6 smd far side: (0,0)
Pad_e661
  rect 2.6x2.6 smd far side: (0,0)
Pad_e667
  rect 2.6x2.6 smd far side: (0,0)
Pad_e668
  rect 2.6x2.6 smd far side: (0,0)
Pad_e674
  rect 2.6x2.6 smd far side: (0,0)
Pad_e675
  rect 2.6x2.6 smd far side: (0,0)
Pad_e681
  rect 2.6x2.6 smd far side: (0,0)
Pad_e682
  rect 2.6x2.6 smd far side: (0,0)
Pad_e688
  rect 2.6x2.6 smd far side: (0,0)
Pad_e689
  rect 2.6x2.6 smd far side: (0,0)
Pad_e695
  rect 2.6x2.6 smd far side: (0,0)
Pad_e696
  rect 2.6x2.6 smd far side: (0,0)
Pad_e702
  rect 2.6x2.6 smd far side: (0,0)
Pad_e703
  rect 2.6x2.6 smd far side: (0,0)
Pad_e709
  rect 2.6x2.6 smd far side: (0,0)
Pad_e710
  rect 2.6x2.6 smd far side: (0,0)
Pad_e716
  rect 2.6x2.6 smd far side: (0,0)
Pad_e717
  rect 2.6x2.6 smd far side: (0,0)
Pad_e723
  rect 2.6x2.6 smd far side: (0,0)
Pad_e724
  rect 2.6x2.6 smd far side: (0,0)
Pad_e730
  rect 2.6x2.6 smd far side: (0,0)
Pad_e731
  rect 2.6x2.6 smd far side: (0,0)
Pad_e737
  rect 2.6x2.6 smd far side: (0,0)
Pad_e738
  rect 2.6x2.6 smd far side: (0,0)
Pad_e744
  rect 2.6x2.6 smd far side: (0,0)
Pad_e745
  rect 2.6x2.6 smd far side: (0,0)
Pad_e751
  rect 2.6x2.6 smd far side: (0,0)
Pad_e752
  rect 2.6x2.6 smd far side: (0,0)
Pad_ie760
  rect 2x1 smd: (0,0)
Pad_ie761
  rect 2x1 smd: (0,0)
Pad_ie762
  rect 2x1 smd: (0,0)
Pad_ie763
  rect 2x1 smd: (0,0)

## Nets
GND: NOREF#3. NOREF#15. NOREF#16. NOREF#17. NOREF#20. NOREF#26. NOREF#27. NOREF#39. NOREF#41. NOREF#42. NOREF#43. NOREF#46. NOREF#51. NOREF#55. NOREF#61. NOREF#63. NOREF#64. NOREF#68. NOREF#71. NOREF#72. NOREF#81.
GND1: NOREF#7. NOREF#52. NOREF#58. NOREF#67.
VCC: NOREF#5. NOREF#12.
+: NOREF#13. NOREF#75.
A: NOREF#22. NOREF#60.
B: NOREF#10. NOREF#57.
D+: NOREF#8. NOREF#84.
D-: NOREF#48. NOREF#82.
DIN: NOREF#2. NOREF#33.
DOWN: NOREF#4. NOREF#56.
HOME: NOREF#35. NOREF#70.
L1: NOREF#18. NOREF#49. NOREF#53.
L2: NOREF#45. NOREF#69.
L3: NOREF#23. NOREF#38. NOREF#77. NOREF#83.
LEFT: NOREF#40. NOREF#50.
R1: NOREF#74. NOREF#76.
R2: NOREF#30. NOREF#78.
R3: NOREF#14. NOREF#24. NOREF#44. NOREF#79.
RIGHT: NOREF#11. NOREF#37.
SELECT: NOREF#21. NOREF#54. NOREF#73.
START: NOREF#6. NOREF#65.
UP: NOREF#25. NOREF#34.
X: NOREF#36. NOREF#66.
Y: NOREF#28. NOREF#47.

## Via types
v1: diameter 0.61, hole 0.305, Top Layer to Bottom Layer, 30 vias

## Routing (per net, layer and track width the routed paths; a pad name or vN(x,y) marks a point on that pad's centre or on a via; arc(x,y) is an arc through that point)
GND: length 698.5
  Top Layer w0.254: v1(187.11,111.63) v1(188.63,111.63) ; 164.08,109.05 v1(164.34,109.31) ; 164.08,109.05 157.22,102.2 151.89,102.2 v1(150.87,101.18) ; 164.08,109.05 v1(159,114.13) ; v1(140.05,64.15) v1(138.28,62.37) ; v1(222.25,56.96) 221.74,56.45 221.74,53.18 222.25,52.67 ; v1(69.77,120.04) 68.36,118.63 v1(55.53,118.63) ; v1(226.94,134.89) 227.68,135.64 232.13,135.64 261.63,165.15 261.63,174.16 262.93,175.46 265.22,175.46 268.47,172.21 268.47,171.4
  Bottom Layer w0.254: 130.15,56.53 135.99,62.37 v1(138.28,62.37) ; 130.15,56.53 106.32,56.53 101.78,61.07 ; 130.15,56.53 130.15,54.26 ; 212.14,117.98 213.16,117.98 224.34,106.8 ; 212.14,117.98 211.13,117.98 207.32,114.17 203,114.17 200.46,111.63 v1(188.63,111.63) ; 212.14,117.98 215.95,121.79 ; v1(226.94,134.89) 225.41,133.37 225.41,131.24 215.95,121.79 ; 215.95,121.79 215.69,121.79 198.35,139.13 ; 170.43,112.61 170.18,112.61 166.88,109.31 v1(164.34,109.31) ; 170.43,112.61 173.68,112.61 173.81,112.74 175.68,110.86 186.35,110.86 v1(187.11,111.63) ; 170.43,112.61 170.43,140.42 170.34,140.52 169.49,140.52 155.54,154.46 149.07,154.46 147,156.53 147,159.07 145.5,160.57 134.07,160.57 132.84,161.8 132.84,169.67 130.43,172.09 123.89,172.09 123.63,171.83 123.63,169.55 122.62,168.53 118.04,168.53 116.77,169.8 113.98,169.8 112.2,168.02 ; 226.02,106.75 225.97,106.8 224.34,106.8 ; 224.34,106.8 222.25,104.71 v1(222.25,56.96) ; v1(140.05,64.15) 141.96,66.06 156.56,66.06 ; 88.89,167.92 88.93,167.92 90.96,169.95 94.72,169.95 96.24,168.43 99.59,168.43 100.62,169.45 100.62,171.73 101.13,172.24 107.99,172.24 112.2,168.02 ; 3.35,92 26.49,92 45.75,111.26 48.03,113.54 52.58,113.54 55.12,116.08 55.12,118.24 55.51,118.63 v1(55.53,118.63) ; 156.56,66.06 156.67,65.95 ; 156.56,66.06 156.56,66.76 149.96,73.37 149.96,99.28 ; 149.96,99.28 150.11,99.4 150.11,100.42 v1(150.87,101.18) ; 149.96,99.28 149.71,99.28 149.45,99.02 131.67,99.02 114.03,116.66 104.85,116.66 99.01,122.51 99.01,122.63 97.05,124.59 84.35,124.59 83.73,123.96 83.73,121.06 82.8,120.14 80.77,120.14 78.99,121.92 73.77,121.92 72.02,120.17 72.02,120.04 v1(69.77,120.04) ; 112.2,168.02 111.89,167.92 ; v1(159,114.13) 158.76,114.13 146.09,126.81
GND1: length 137.5
  Bottom Layer w0.254: 19.86,166.9 20.62,166.14 40.94,166.14 42.72,167.91 42.88,167.91 ; 19.86,166.9 19.86,96.57 17.29,94 3.35,94 ; 19.86,166.9 19.86,167.89 19.89,167.92 ; 42.88,167.91 42.88,167.92 ; 42.88,167.91 44.66,166.14 64.1,166.14 65.89,167.92
VCC: length 160.5
  Top Layer w0.254: 263.97,174.6 262.45,173.08 262.45,131.26 214.12,82.93 214.12,35.69 214.76,35.05
+: length 148.8
  Bottom Layer w0.254: 137,158.5 137,131.82 165.35,103.47 165.35,101.94 222.25,45.05
A: length 138
  Top Layer w0.254: v1(163.61,85.18) 163.61,83.91 214.25,33.27 255.14,33.27 256.67,34.8 256.67,35.31 255.65,36.32 254.13,36.32 252.86,35.05
  Bottom Layer w0.254: v1(163.61,85.18) 163.61,101.94
B: length 117.2
  Top Layer w0.254: v1(214.76,87.83) v1(190.37,112.21)
  Bottom Layer w0.254: 250.32,35.05 249.05,33.78 239.9,33.78 238.89,34.8 238.89,35.56 237.36,37.08 232.28,37.08 223.9,45.47 223.9,54.36 214.76,63.5 v1(214.76,87.83) ; v1(190.37,112.21) 187.31,115.28
D+: length 140.9
  Bottom Layer w0.254: 222.25,50.13 161.29,111.09 161.29,136.91 143.67,154.53 143.67,158.5
D-: length 144.8
  Bottom Layer w0.254: 222.25,47.59 140.33,129.51 140.33,158.5
DIN: length 163.8
  Top Layer w0.254: 217.3,35.05 215.01,37.34 215.01,82.55 269.88,137.41 269.88,173.2 268.47,174.6
DOWN: length 187.1
  Top Layer w0.254: v1(146.94,99.82) 214,32.77 258.19,32.77 260.48,35.05
  Bottom Layer w0.254: v1(146.94,99.82) 138.81,99.82 113.67,124.97 112.58,124.97 112.51,125.05
HOME: length 245.1
  Top Layer w0.254: v1(33.4,168.66) 33.4,166.62 79.38,120.65 84.45,120.65 142.37,62.74 v1(142.37,62.23)
  Bottom Layer w0.254: 219.84,35.05 192.66,62.23 v1(142.37,62.23) ; v1(33.4,168.66) 33.4,170.44 33.38,170.46
L1: length 277
  Top Layer w0.254: v1(123.64,115.95) v1(93.41,115.95) ; v1(136.08,115.95) 177.23,115.95 179.77,113.41 184.6,113.41 190.19,119 231.84,119 239.26,111.58 v1(239.26,111.07) ; v1(65.72,115.95) v1(63.95,115.95)
  Bottom Layer w0.254: 242.7,35.05 239.52,38.23 233.04,38.23 225.43,45.85 225.43,93.98 239.52,108.07 239.52,110.81 v1(239.26,111.07) ; v1(63.95,115.95) 62.1,115.95 ; v1(136.08,115.95) v1(123.64,115.95) ; v1(93.41,115.95) v1(65.72,115.95)
L2: length 116.4
  Bottom Layer w0.254: 240.16,35.05 240.16,35.41 237.98,37.59 232.66,37.59 224.54,45.72 224.54,94.49 237.72,107.67 237.72,110.59 238.63,111.51 238.63,135.63 238.91,135.91
L3: length 285.2
  Bottom Layer w0.254: 102.39,170.46 102.39,167.92 61.09,126.62 61.09,114.17 62.12,113.14 67.78,113.14 115.28,65.65 115.28,63.61 115.4,63.5 200.53,63.5 228.73,35.31 228.73,34.8 229.74,33.78 236.35,33.78 237.62,35.05
LEFT: length 220
  Top Layer w0.254: v1(114.43,115.32) 123.32,115.32 129.67,108.97 131.7,108.97 208.41,32.26 259.21,32.26 261.75,34.8 261.75,35.31 260.73,36.32 259.21,36.32 257.94,35.05
  Bottom Layer w0.254: v1(114.43,115.32) 95.12,115.32 87.86,122.58 85.52,122.58
R1: length 88.8
  Bottom Layer w0.254: 213.96,114.17 213.96,63.53 223.39,54.1 223.39,45.21 232.16,36.45 233.68,36.45 235.08,35.05
R2: length 129.5
  Top Layer w0.254: 232.54,35.05 223.65,43.94 221.36,43.94 221.11,44.2 221.11,56.9 222.12,57.91 v1(223.14,57.91)
  Bottom Layer w0.254: v1(223.14,57.91) 223.14,100.46 227.71,105.03 227.71,108.2 225.68,110.24 225.68,121.92 227.02,123.26 227.02,134.11 227.53,134.62 227.53,135.13 220.99,141.67 211.85,141.67
R3: length 265.9
  Bottom Layer w0.254: 125.47,127.68 124.2,128.95 109.26,128.95 108.33,128.02 108.33,127.25 106.3,125.22 85.22,125.22 84.07,126.36 82.17,126.36 81.28,125.48 81.28,124.71 79.16,122.6 71.44,122.6 63.41,114.56 62.13,114.56 ; 125.47,127.68 151.88,101.26 151.88,95.16 170.17,76.88 170.17,68.49 196.56,68.49 230,35.05 ; 125.47,127.68 125.47,170.38 125.38,170.46
RIGHT: length 152.3
  Top Layer w0.254: v1(148.46,101.35) 164.21,85.6 164.21,84.07 214.5,33.78 254.13,33.78 255.4,35.05
  Bottom Layer w0.254: v1(148.46,101.35) 145.39,101.35 136.28,110.45
SELECT: length 278.1
  Bottom Layer w0.254: 56.39,170.46 66.4,170.46 67.56,169.29 67.56,166.5 58.13,157.06 58.13,110.91 58.55,110.49 62.1,110.49 ; 62.1,110.49 62.1,108.71 109.09,61.72 116.46,61.72 117.73,62.99 199.52,62.99 227.46,35.05 ; 62.1,110.49 62.1,111.76
START: length 202.3
  Top Layer w0.254: v1(193.68,62.23) 154.56,101.35 152.02,101.35 151.26,100.58 150.5,100.58 v1(92.33,158.75)
  Bottom Layer w0.254: 224.92,35.05 197.74,62.23 v1(193.68,62.23) ; v1(92.33,158.75) 91.09,158.75 79.39,170.46
UP: length 129.8
  Bottom Layer w0.254: 263.02,35.05 261.24,33.27 215.01,33.27 191.49,56.79 143.65,56.79
X: length 147.5
  Top Layer w0.254: 247.78,35.05 245.75,37.08 232.28,37.08 223.9,45.47 223.9,58.17 223.39,58.67 218.82,58.67 v1(215.77,55.63)
  Bottom Layer w0.254: v1(215.77,55.63) 159.59,111.81 159.59,129.35
Y: length 141.2
  Top Layer w0.254: 245.24,35.05 243.84,36.45 231.9,36.45 223.39,44.96 223.39,53.09 v1(222.38,54.1)
  Bottom Layer w0.254: v1(222.38,54.1) 187.83,88.65 187.83,111.76 186.06,113.54 185.8,113.54 185.55,113.79 185.55,116.59 186.31,117.35 186.31,140.59 183.84,143.06

## Text on the board
Bottom Silkscreen Layer: L1 | R3 | L3 | SELECT | 5V | D- | D+ | GND
Top Silkscreen Layer: JLCJLCJLCJLC | HSNI | GND
